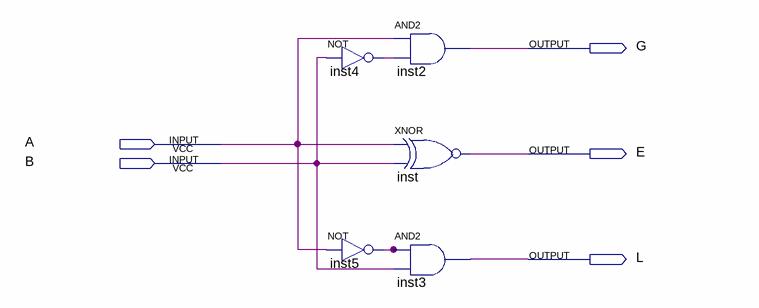
[diagram p0: schematic sheet]
// Quartus schematic comparador1bit.bdf as structural Verilog: 5 symbols, 5 pins
module comparador1bit (
  input  A,
  input  B,
  output G,
  output E,
  output L
);

  wire inst4_out, inst5_out;

  not inst4 (inst4_out, B);
  not inst5 (inst5_out, A);
  and inst2 (G, A, inst4_out);
  xnor inst (E, A, B);
  and inst3 (L, inst5_out, B);
endmodule
